# EAGLE design hfm_adapter_nucleo-32 (EAGLE 9.1.1)

## Sheet 1 of 5: MCU
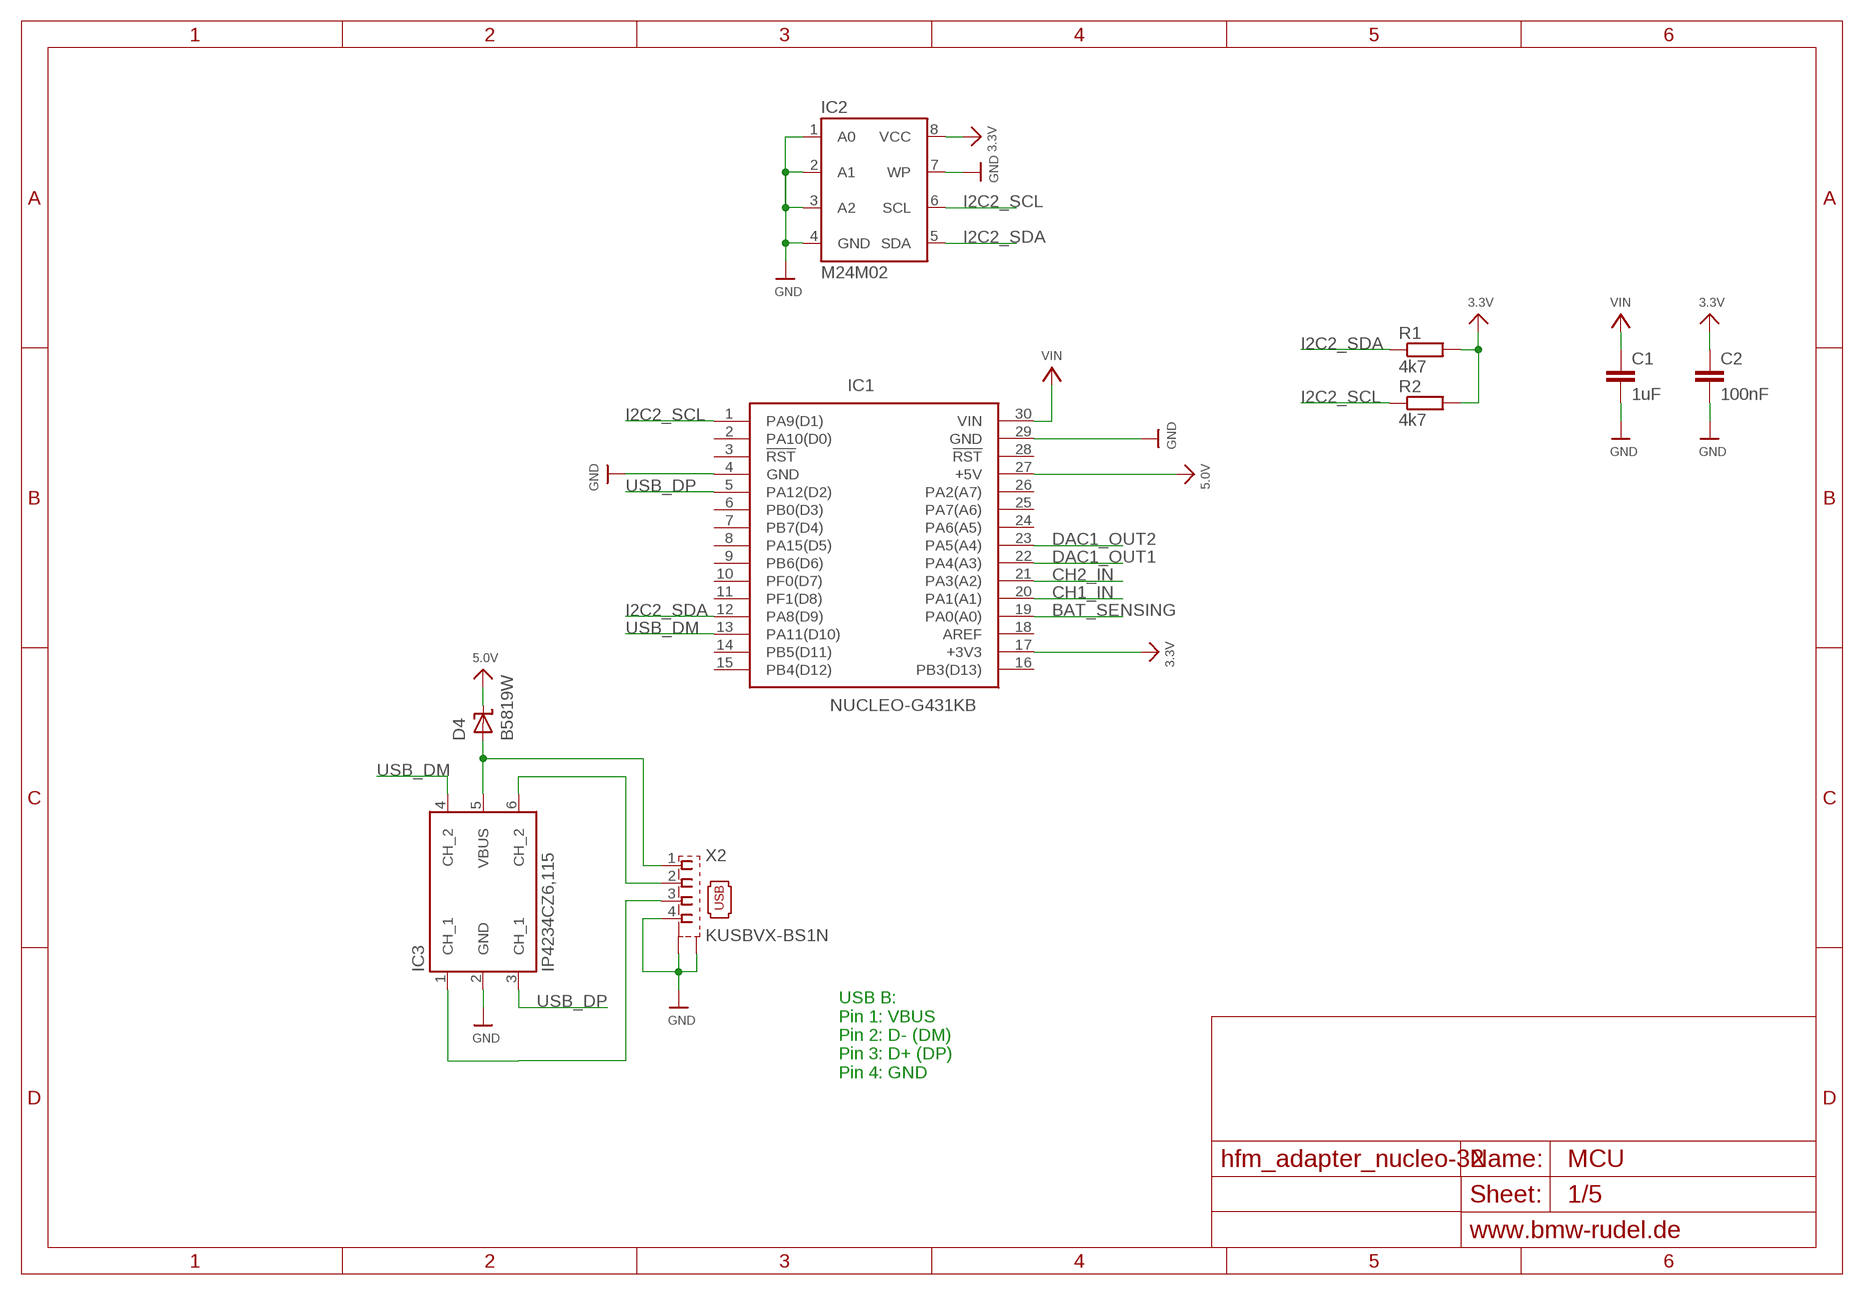
[diagram p0: schematic, sheet 1]

### Parts
C1  1uF  C-EUC0805  [C0805]
C2  100nF  C-EUC0805  [C0805]
D4  B5819W  SHOTTKYSOD-123  [SOD-123]
IC1  NUCLEO-G431KB  [DIPS1524W66P254L5029H1500Q30N]
IC2  M24M02  EEPROM_I2CSO8  [SO8]
IC3  IP4234CZ6,115  [SOT95P275X110-6N]
R1  4k7  R-EU_R0805  [R0805]
R2  4k7  R-EU_R0805  [R0805]
X2  KUSBVX-BS1N  [KUSBVX-BS1N]

### Nets
3.3V: C2.1 IC1.17(+3V3) IC2.8(VCC) R1.2 R2.2 ; also sheet 2
5.0V: D4.C IC1.27(+5V) ; also sheet 2
BAT_SENSING: IC1.19(PA0(A0)) ; also sheet 2
CH1_IN: IC1.20(PA1(A1)) ; also sheet 2
CH2_IN: IC1.21(PA3(A2)) ; also sheet 2
DAC1_OUT1: IC1.22(PA4(A3)) ; also sheet 3
DAC1_OUT2: IC1.23(PA5(A4)) ; also sheet 3
GND: C1.2 C2.2 IC1.4(GND) IC1.29(GND) IC2.1(A0) IC2.2(A1) IC2.3(A2) IC2.4(GND) IC2.7(WP) IC3.2(GND) X2.4 X2.M1(S1) X2.M2(S2) ; also sheet 2,3,4,5
I2C2_SCL: IC1.1(PA9(D1)) IC2.6(SCL) R2.1 ; also sheet 2
I2C2_SDA: IC1.12(PA8(D9)) IC2.5(SDA) R1.1 ; also sheet 2
N$9: IC3.1(CH_1) X2.3
N$12: IC3.6(CH_2) X2.2
N$14: D4.A IC3.5(VBUS) X2.1
USB_DM: IC1.13(PA11(D10)) IC3.4(CH_2)
USB_DP: IC1.5(PA12(D2)) IC3.3(CH_1)
VIN: C1.1 IC1.30(VIN) ; also sheet 3,4
Unconnected: IC1.2(PA10(D0)) IC1.3(!RST) IC1.6(PB0(D3)) IC1.7(PB7(D4)) IC1.8(PA15(D5)) IC1.9(PB6(D6)) IC1.10(PF0(D7)) IC1.11(PF1(D8)) IC1.14(PB5(D11)) IC1.15(PB4(D12)) IC1.16(PB3(D13)) IC1.18(AREF) IC1.24(PA6(A5)) IC1.25(PA7(A6)) IC1.26(PA2(A7)) IC1.28(!RST)

### Notes on the sheet
- USB B:
  Pin 1: VBUS
  Pin 2: D- (DM)
  Pin 3: D+ (DP)
  Pin 4: GND

## Sheet 2 of 5: Input
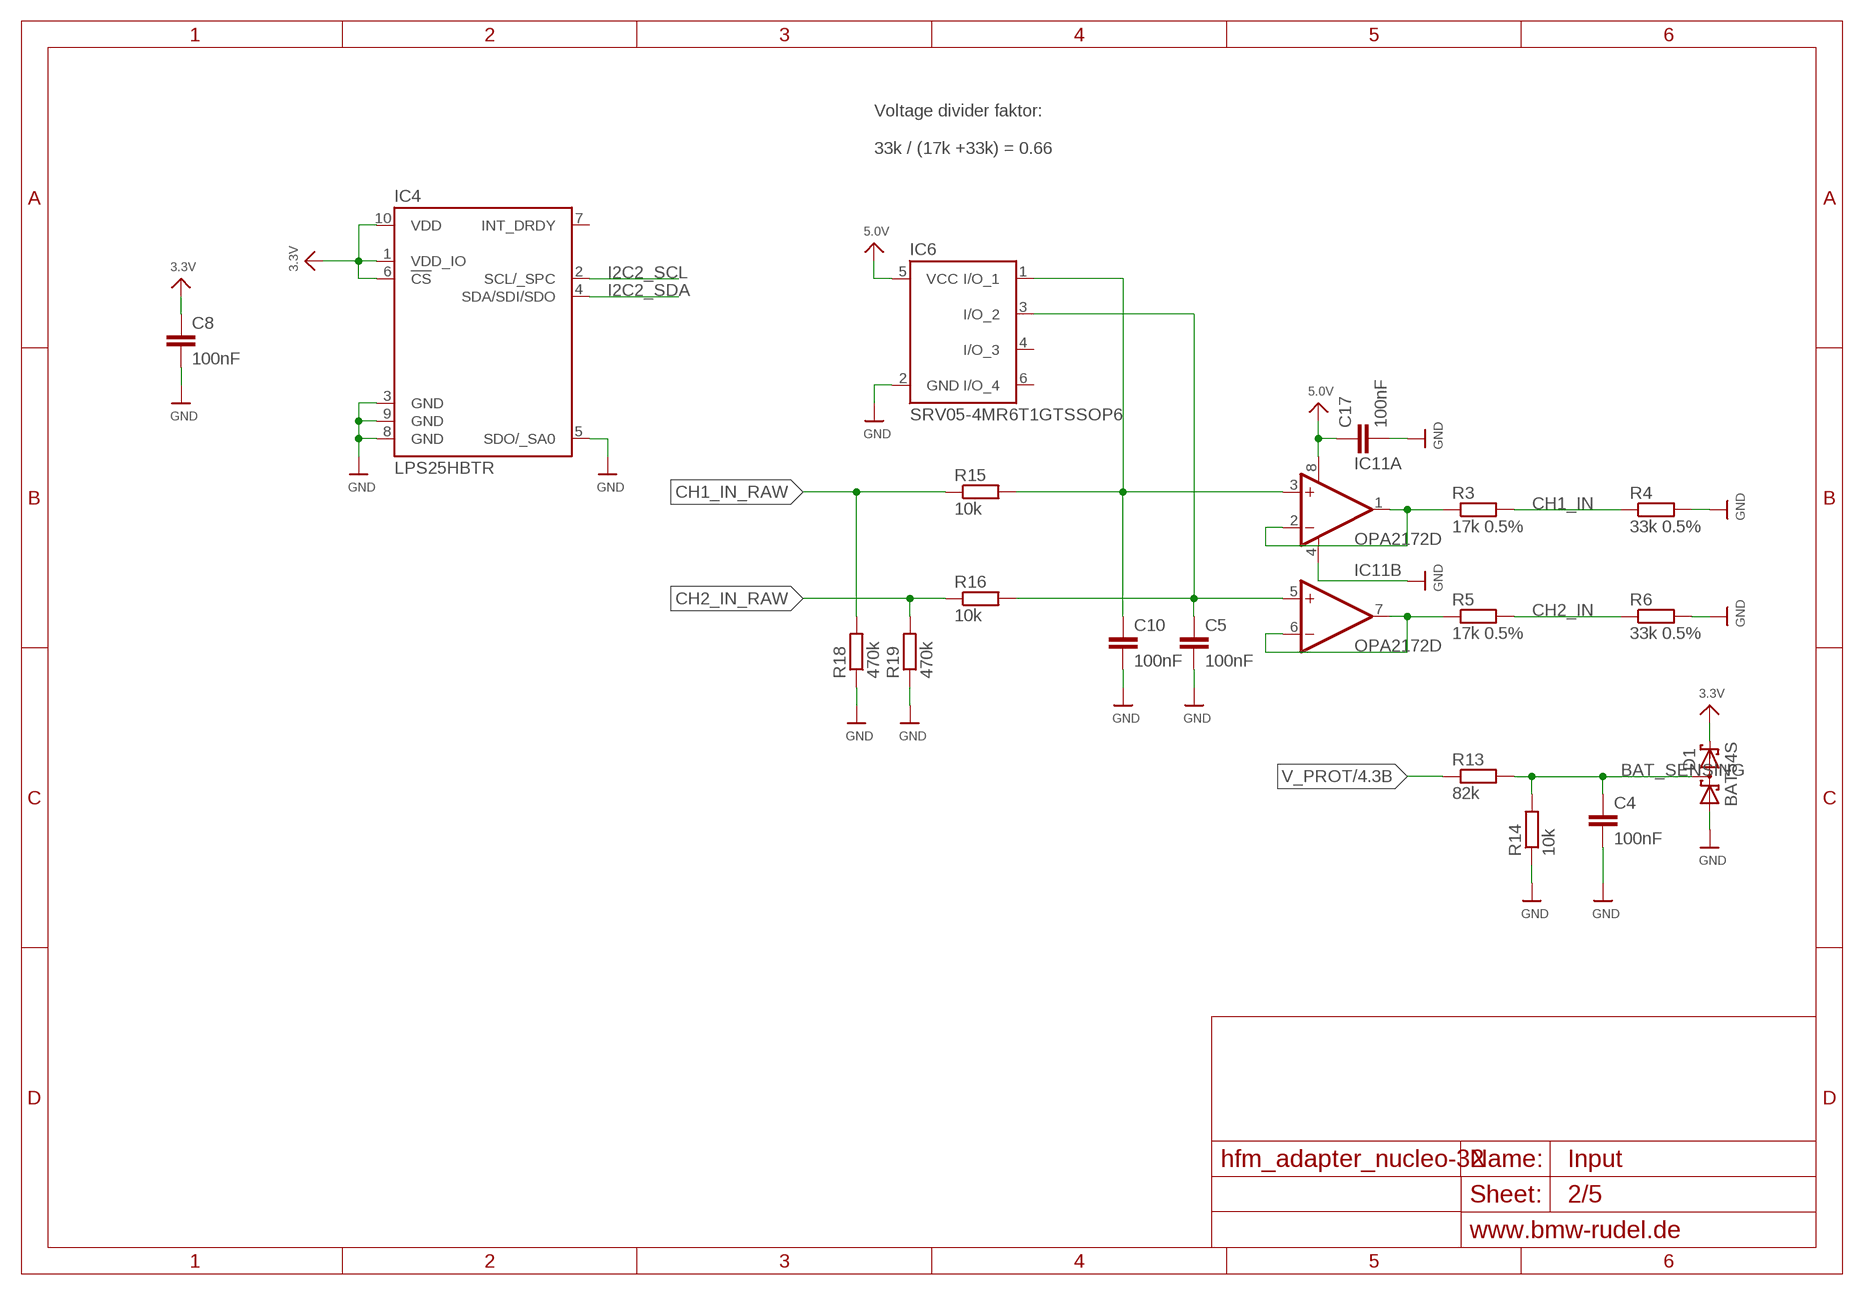
[diagram p1: schematic, sheet 2]

### Parts
C4  100nF  C-EUC0805  [C0805]
C5  100nF  C-EUC0805  [C0805]
C8  100nF  C-EUC0805  [C0805]
C10  100nF  C-EUC0805  [C0805]
C17  100nF  C-EUC0805  [C0805]
D1  BAT54S  [SOT23]
IC4  LPS25HBTR  [LPS25HBTR]
IC6  SRV05-4MR6T1GTSSOP6  [TSSOP6]
IC11  OPA2172D  [SO08]
R3  17k 0.5%  R-EU_R0805  [R0805]
R4  33k 0.5%  R-EU_R0805  [R0805]
R5  17k 0.5%  R-EU_R0805  [R0805]
R6  33k 0.5%  R-EU_R0805  [R0805]
R13  82k  R-EU_R0805  [R0805]
R14  10k  R-EU_R0805  [R0805]
R15  10k  R-EU_R0805  [R0805]
R16  10k  R-EU_R0805  [R0805]
R18  470k  R-EU_R0805  [R0805]
R19  470k  R-EU_R0805  [R0805]

### Nets
3.3V: C8.1 D1.2(K2) IC4.1(VDD_IO) IC4.6(!CS) IC4.10(VDD) ; also sheet 1
5.0V: C17.1 IC6.5(VCC) IC11.8(A:V+) ; also sheet 1
BAT_SENSING: C4.1 D1.3(K1A2) R13.2 R14.2 ; also sheet 1
CH1_IN: R3.2 R4.1 ; also sheet 1
CH1_IN_RAW: R15.1 R18.2 ; also sheet 5
CH2_IN: R5.2 R6.1 ; also sheet 1
CH2_IN_RAW: R16.1 R19.2 ; also sheet 5
GND: C4.2 C5.2 C8.2 C10.2 C17.2 D1.1(A1) IC4.3(GND) IC4.5(SDO/_SA0) IC4.8(GND) IC4.9(GND) IC6.2(GND) IC11.4(A:V-) R4.2 R6.2 R14.1 R18.1 R19.1 ; also sheet 1,3,4,5
I2C2_SCL: IC4.2(SCL/_SPC) ; also sheet 1
I2C2_SDA: IC4.4(SDA/SDI/SDO) ; also sheet 1
N$1: IC11.1(A:OUT) IC11.2(A:-IN) R3.1
N$3: C10.1 IC6.1(I/O_1) IC11.3(A:+IN) R15.2
N$6: IC11.6(B:-IN) IC11.7(B:OUT) R5.1
N$8: C5.1 IC6.3(I/O_2) IC11.5(B:+IN) R16.2
V_PROT: R13.1 ; also sheet 4
Unconnected: IC4.7(INT_DRDY) IC6.4(I/O_3) IC6.6(I/O_4)

### Notes on the sheet
- Voltage divider faktor:
  
  33k / (17k +33k) = 0.66

## Sheet 3 of 5: Output
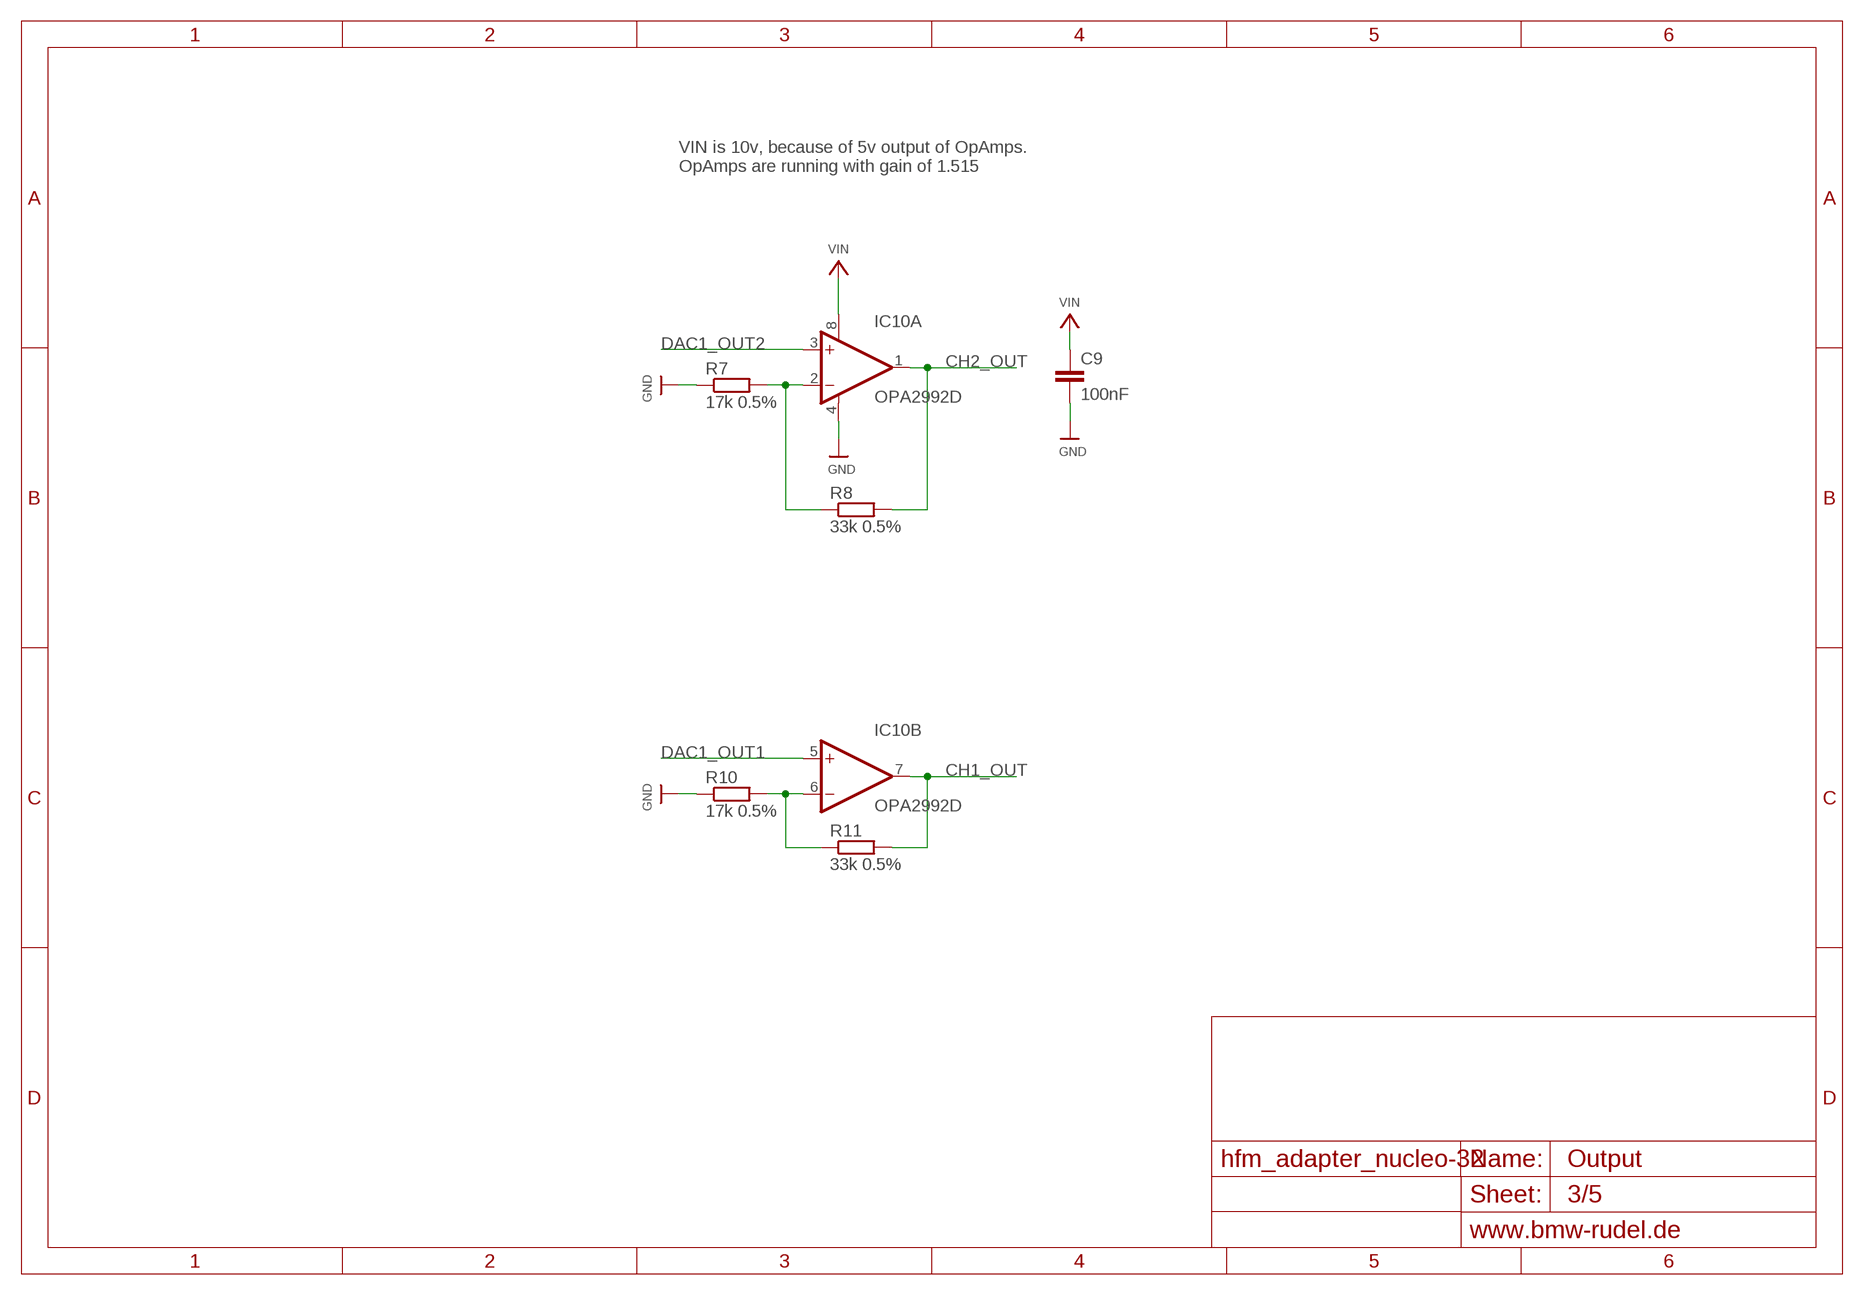
[diagram p2: schematic, sheet 3]

### Parts
C9  100nF  C-EUC0805  [C0805]
IC10  OPA2992D  OPA2172D  [SO08]
R7  17k 0.5%  R-EU_R0805  [R0805]
R8  33k 0.5%  R-EU_R0805  [R0805]
R10  17k 0.5%  R-EU_R0805  [R0805]
R11  33k 0.5%  R-EU_R0805  [R0805]

### Nets
CH1_OUT: IC10.7(B:OUT) R11.2 ; also sheet 5
CH2_OUT: IC10.1(A:OUT) R8.2 ; also sheet 5
DAC1_OUT1: IC10.5(B:+IN) ; also sheet 1
DAC1_OUT2: IC10.3(A:+IN) ; also sheet 1
GND: C9.2 IC10.4(A:V-) R7.1 R10.1 ; also sheet 1,2,4,5
N$2: IC10.6(B:-IN) R10.2 R11.1
N$4: IC10.2(A:-IN) R7.2 R8.1
VIN: C9.1 IC10.8(A:V+) ; also sheet 1,4

### Notes on the sheet
- VIN is 10v, because of 5v output of OpAmps.
  OpAmps are running with gain of 1.515

## Sheet 4 of 5: Power
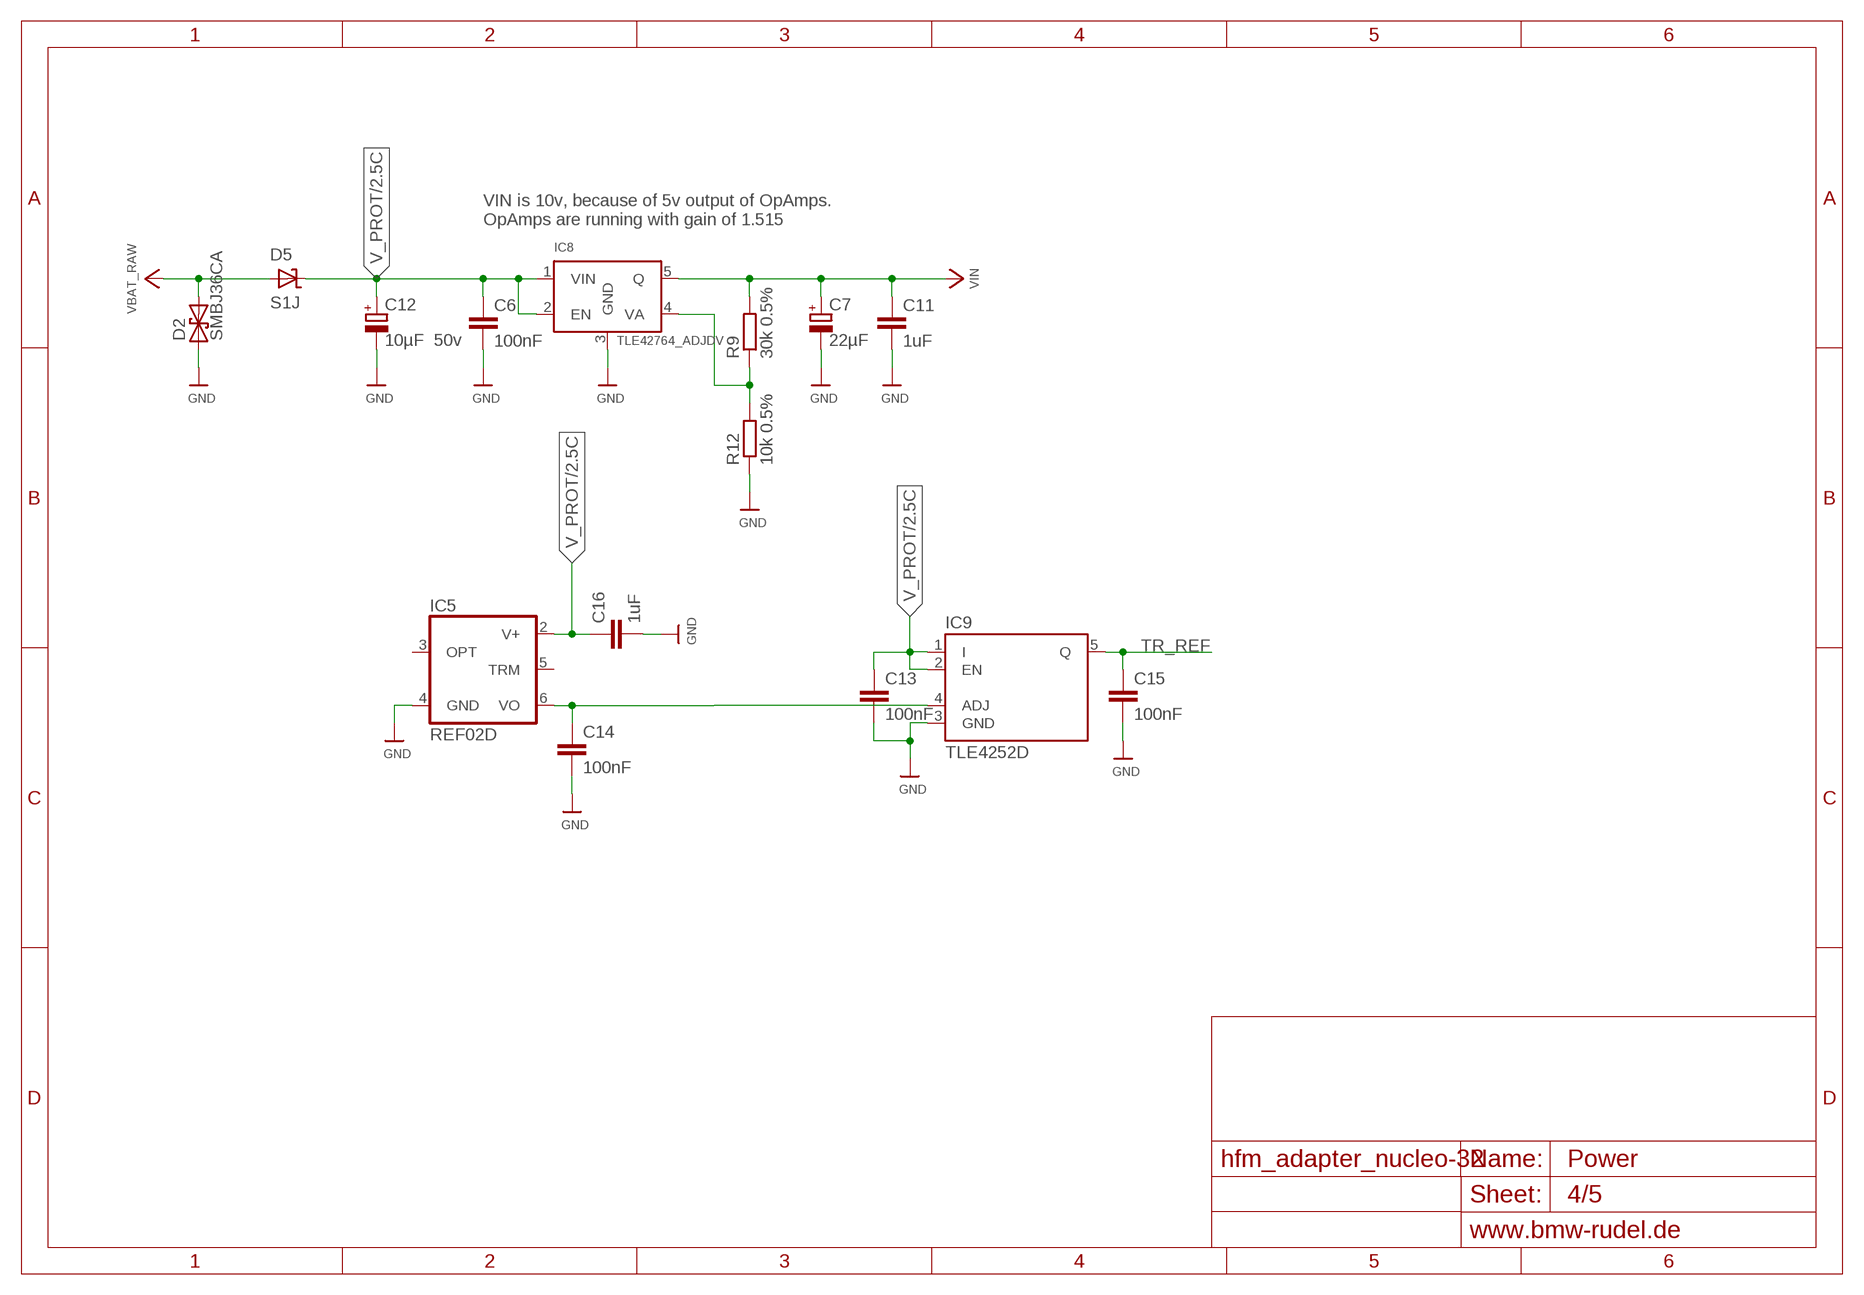
[diagram p3: schematic, sheet 4]

### Parts
C6  100nF  C-EUC1206  [C1206]
C7  22µF  CPOL-EUC  [PANASONIC_C]
C11  1uF  C-EUC0805  [C0805]
C12  10µF 50v  CPOL-EUD  [PANASONIC_D]
C13  100nF  C-EUC0805  [C0805]
C14  100nF  C-EUC0805  [C0805]
C15  100nF  C-EUC0805  [C0805]
C16  1uF  C-EUC0805  [C0805]
D2  SMBJ36CA  TVS_BIA  [DO214AA]
D5  S1J  SHOTTKYSMA  [DO214AC]
IC5  REF02D  [SO08]
IC8  TLE42764_ADJDV  [TO252-51]
IC9  TLE4252D  [TO252-51]
R9  30k 0.5%  R-EU_R0805  [R0805]
R12  10k 0.5%  R-EU_R0805  [R0805]

### Nets
GND: C6.2 C7.- C11.2 C12.- C13.2 C14.2 C15.2 C16.2 D2.A IC5.4(GND) IC8.3(GND) IC9.3(GND) R12.1 ; also sheet 1,2,3,5
N$5: IC8.4(VA) R9.1 R12.2
TR_REF: C15.1 IC9.5(Q) ; also sheet 5
V_PROT: C6.1 C12.+ C13.1 C16.1 D5.C IC5.2(V+) IC8.1(VIN) IC8.2(EN) IC9.1(I) IC9.2(EN) ; also sheet 2
VBAT_RAW: D2.C D5.A ; also sheet 5
VIN: C7.+ C11.1 IC8.5(Q) R9.2 ; also sheet 1,3
VREF: C14.1 IC5.6(VO) IC9.4(ADJ)
Unconnected: IC5.3(OPT) IC5.5(TRM)

### Notes on the sheet
- VIN is 10v, because of 5v output of OpAmps.
  OpAmps are running with gain of 1.515

## Sheet 5 of 5: Connections
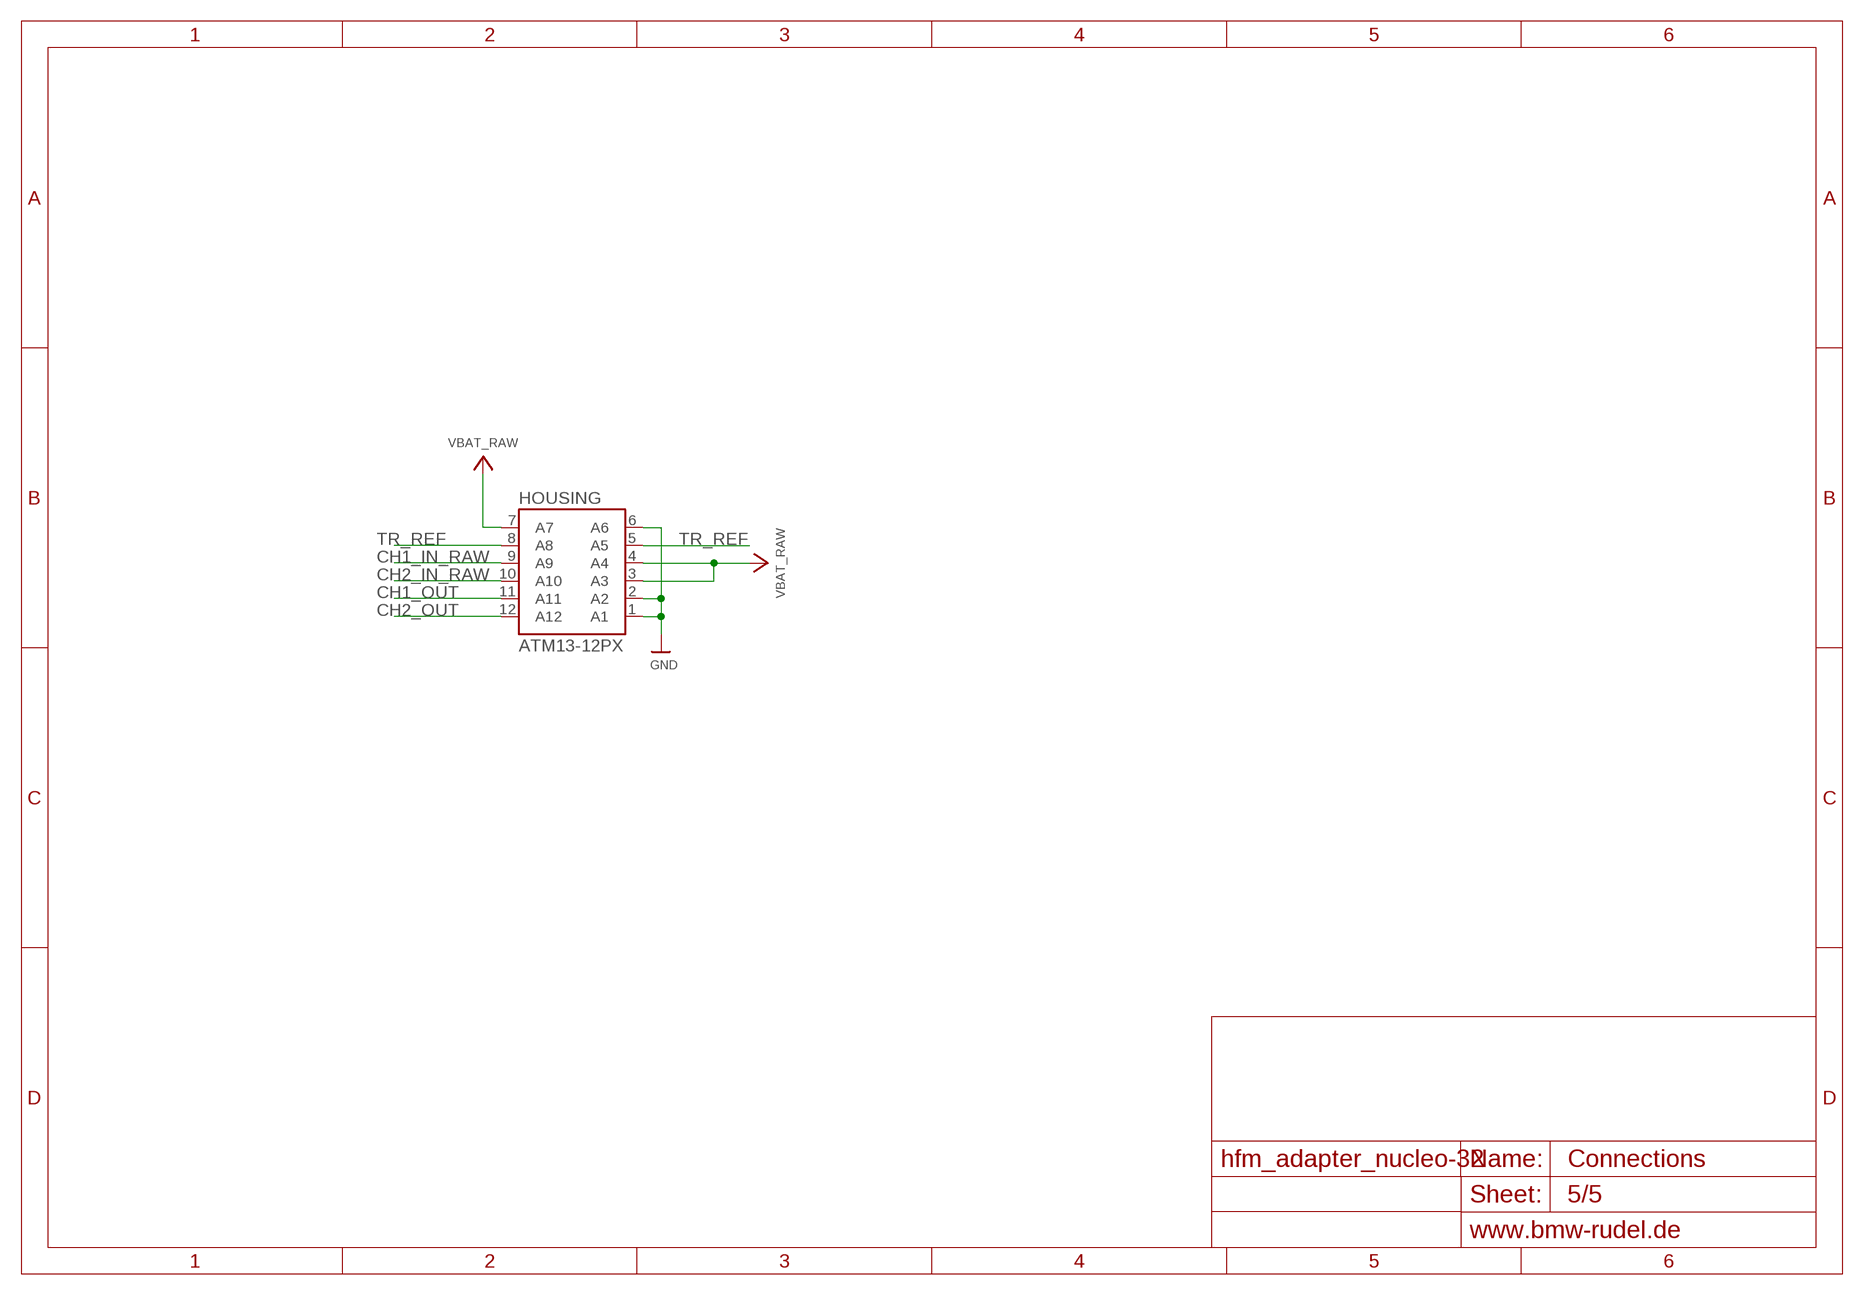
[diagram p4: schematic, sheet 5]

### Parts
HOUSING  ATM13-12PX  [ATM13-12PX]

### Nets
CH1_IN_RAW: HOUSING.9(A9) ; also sheet 2
CH1_OUT: HOUSING.11(A11) ; also sheet 3
CH2_IN_RAW: HOUSING.10(A10) ; also sheet 2
CH2_OUT: HOUSING.12(A12) ; also sheet 3
GND: HOUSING.1(A1) HOUSING.2(A2) HOUSING.6(A6) ; also sheet 1,2,3,4
TR_REF: HOUSING.5(A5) HOUSING.8(A8) ; also sheet 4
VBAT_RAW: HOUSING.3(A3) HOUSING.4(A4) HOUSING.7(A7) ; also sheet 4

## Library data of the parts
C1 C2 C4-C6 C8-C11 C13-C17 = rcl:C-EU: CAPACITOR, European symbol; SPICEPREFIX: C
C7 C12 = rcl:CPOL-EU: POLARIZED CAPACITOR, European symbol; SPICEPREFIX: C
D1 = nxp_60_1_1:BAT54S: Schottky barrier (double) diodes Planar Schottky barrier diodes encapsulated in a SOT23 small plastic SMD package. Single diodes and double diodes with different pinning are available. AAL Eindhoven MK
D2 = Heinrich:TVS_BI
D4 D5 = Heinrich:SHOTTKY
HOUSING = Heinrich:ATM13-12PX
IC1 = NUCLEO-G431KB:NUCLEO-G431KB: STM32 Nucleo-32 development board Source: Datasheet <http://www.st.com/content/ccc/resource/technical/document/data_brief/b1/d8/13/d4/b0/b7/4b/6e/DM00214578.pdf/files/DM00214578.pdf/jcr:content/translations/en.DM00214578.pdf>; ARROW_PART_NUMBER: NUCLEO-F303K8; ARROW_PRICE-STOCK: https://www.arrow.com/en/products/nucleo-f303k8/stmicroelectronics; DESCRIPTION: STM32 Nucleo-32 development board; HEIGHT: 15mm; MANUFACTURER_NAME: STMicroelectronics; MANUFACTURER_PART_NUMBER: NUCLEO-F303K8; RS_PART_NUMBER: 9092862; RS_PRICE-STOCK: http://uk.rs-online.com/web/p/products/9092862
IC2 = Heinrich:EEPROM_I2C: I²C EEPROM IC, i.e. FT24C256A
IC3 = Heinrich:IP4234CZ6,115: ESD Suppressors / TVS Diodes ESD PRTCT/HI SPD INF ZEN LOW VLTG CLMP Source: Datasheet <https://assets.nexperia.com/documents/data-sheet/IP4234CZ6.pdf>; ARROW_PART_NUMBER: IP4234CZ6,115; ARROW_PRICE-STOCK: null?region=nac; DESCRIPTION: ESD Suppressors / TVS Diodes ESD PRTCT/HI SPD INF ZEN LOW VLTG CLMP; HEIGHT: 1.1mm; MANUFACTURER_NAME: Nexperia; MANUFACTURER_PART_NUMBER: IP4234CZ6,115; MOUSER_PART_NUMBER: 771-IP4234CZ6; MOUSER_PRICE-STOCK: https://www.mouser.co.uk/ProductDetail/Nexperia/IP4234CZ6115?qs=iS%252BvaFGfLooAQ%252BprbRTkIg%3D%3D
IC4 = Heinrich:LPS25HBTR: Board Mount Pressure Sensor 26kPa to 126kPa Absolute 10-Pin HLGA T/R Source: Datasheet <https://www.st.com/resource/en/datasheet/lps25hb.pdf>; ARROW_PART_NUMBER: LPS25HBTR; ARROW_PRICE-STOCK: https://www.arrow.com/en/products/lps25hbtr/stmicroelectronics; DESCRIPTION: Board Mount Pressure Sensor 26kPa to 126kPa Absolute 10-Pin HLGA T/R; HEIGHT: 0.8mm; MANUFACTURER_NAME: STMicroelectronics; MANUFACTURER_PART_NUMBER: LPS25HBTR; MOUSER_PART_NUMBER: 511-LPS25HBTR; MOUSER_PRICE-STOCK: https://www.mouser.co.uk/ProductDetail/STMicroelectronics/LPS25HBTR?qs=GDOUxV2YAh9IvjPyBKWGzQ%3D%3D
IC5 = linear:REF02: VOLTAGE REFERENCE
IC6 = Heinrich:SRV05-4MR6T1G; ARROW_PART_NUMBER: SRV05-4MR6T1G; ARROW_PRICE-STOCK: https://www.arrow.com/en/products/srv05-4mr6t1g/on-semiconductor?region=nac; DESCRIPTION: ON SEMICONDUCTOR - SRV05-4MR6T1G - ESD Protection Device, 17.5 V, TSOP, 6 Pins, 300 W; HEIGHT: 1.1mm; MANUFACTURER_NAME: onsemi; MANUFACTURER_PART_NUMBER: SRV05-4MR6T1G; MOUSER_PART_NUMBER: 863-SRV05-4MR6T1G; MOUSER_PRICE-STOCK: https://www.mouser.co.uk/ProductDetail/onsemi/SRV05-4MR6T1G?qs=unWjWFgkqcg61n2fM3DdZg%3D%3D
IC8 = Heinrich:TLE42764_ADJ
IC9 = Heinrich:TLE4252D: Infineon Tracking regualtor output tracking tolerance to reference <= 0.2% 250mA max current
IC10 IC11 = Heinrich:OPA2172: Operational Amplifier; MF: TEXAS INSTRUMENTS; MPN: OPA2234U; OC_FARNELL: 1212441; OC_NEWARK: 96K4523
R1-R16 R18 R19 = rcl:R-EU_: RESISTOR, European symbol; SPICEPREFIX: R
X2 = con-kycon:KUSBVX-BS1N: USB B-type Receptacle Vertical, 4 Position, Through Hole Source: Sibalco Kycon KUSBVX-BS1N-xxx.pdf

## Board
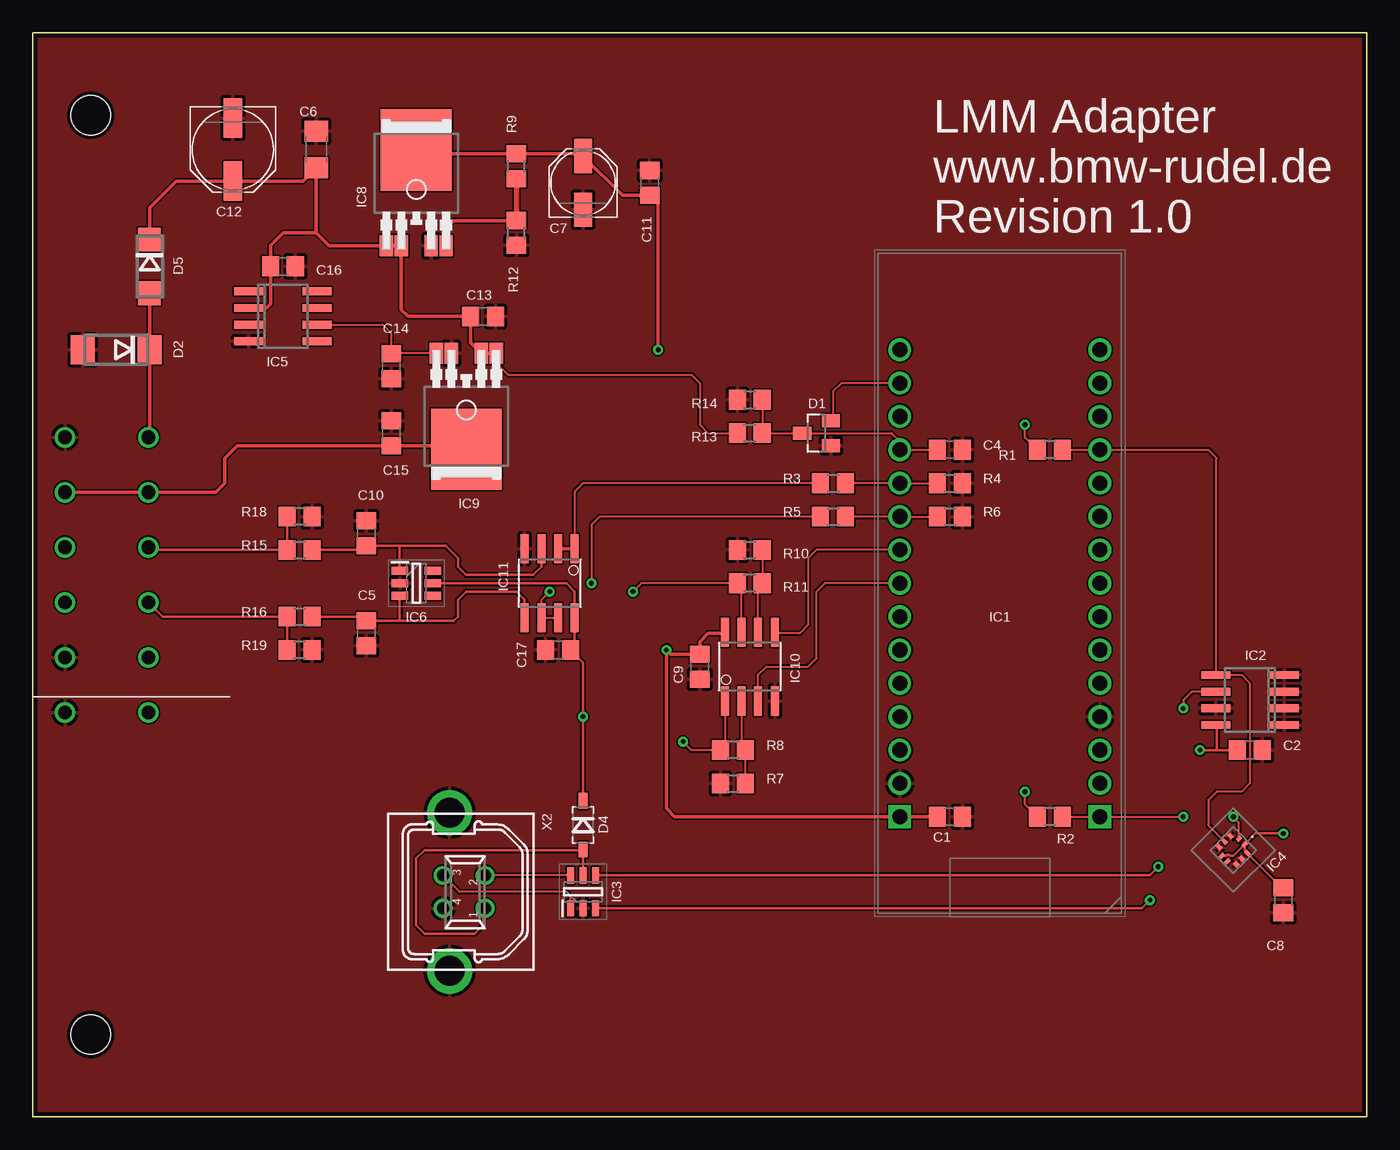
[diagram p5: board, top side]
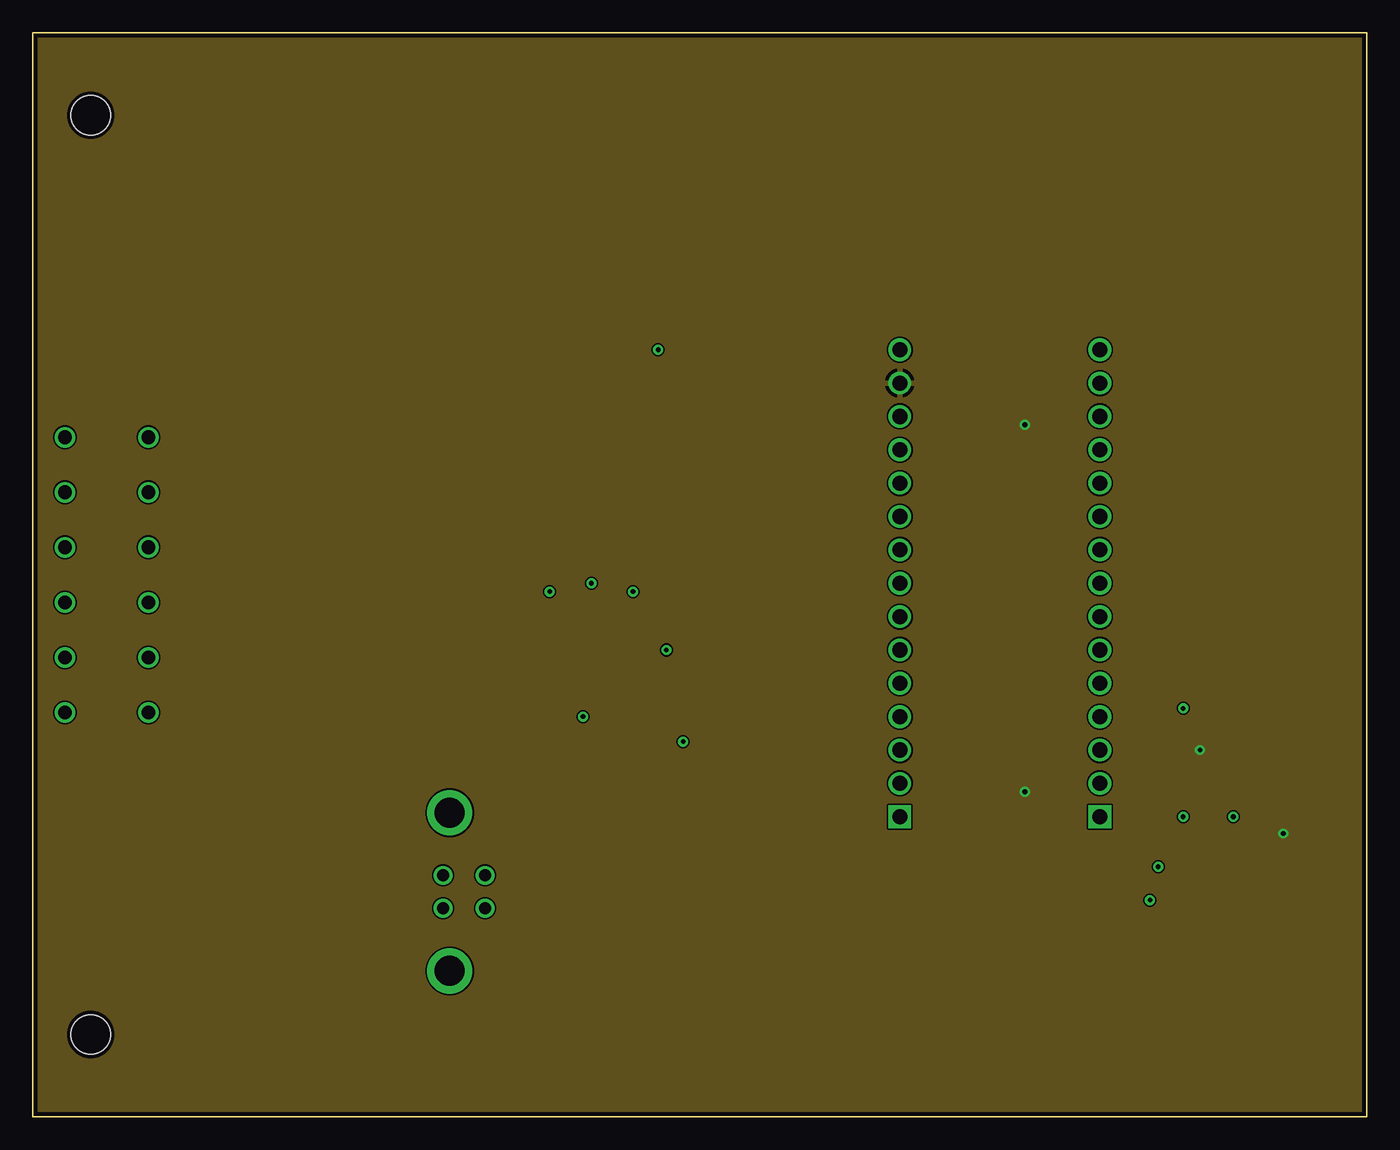
[diagram p6: board, inner layer Route2]
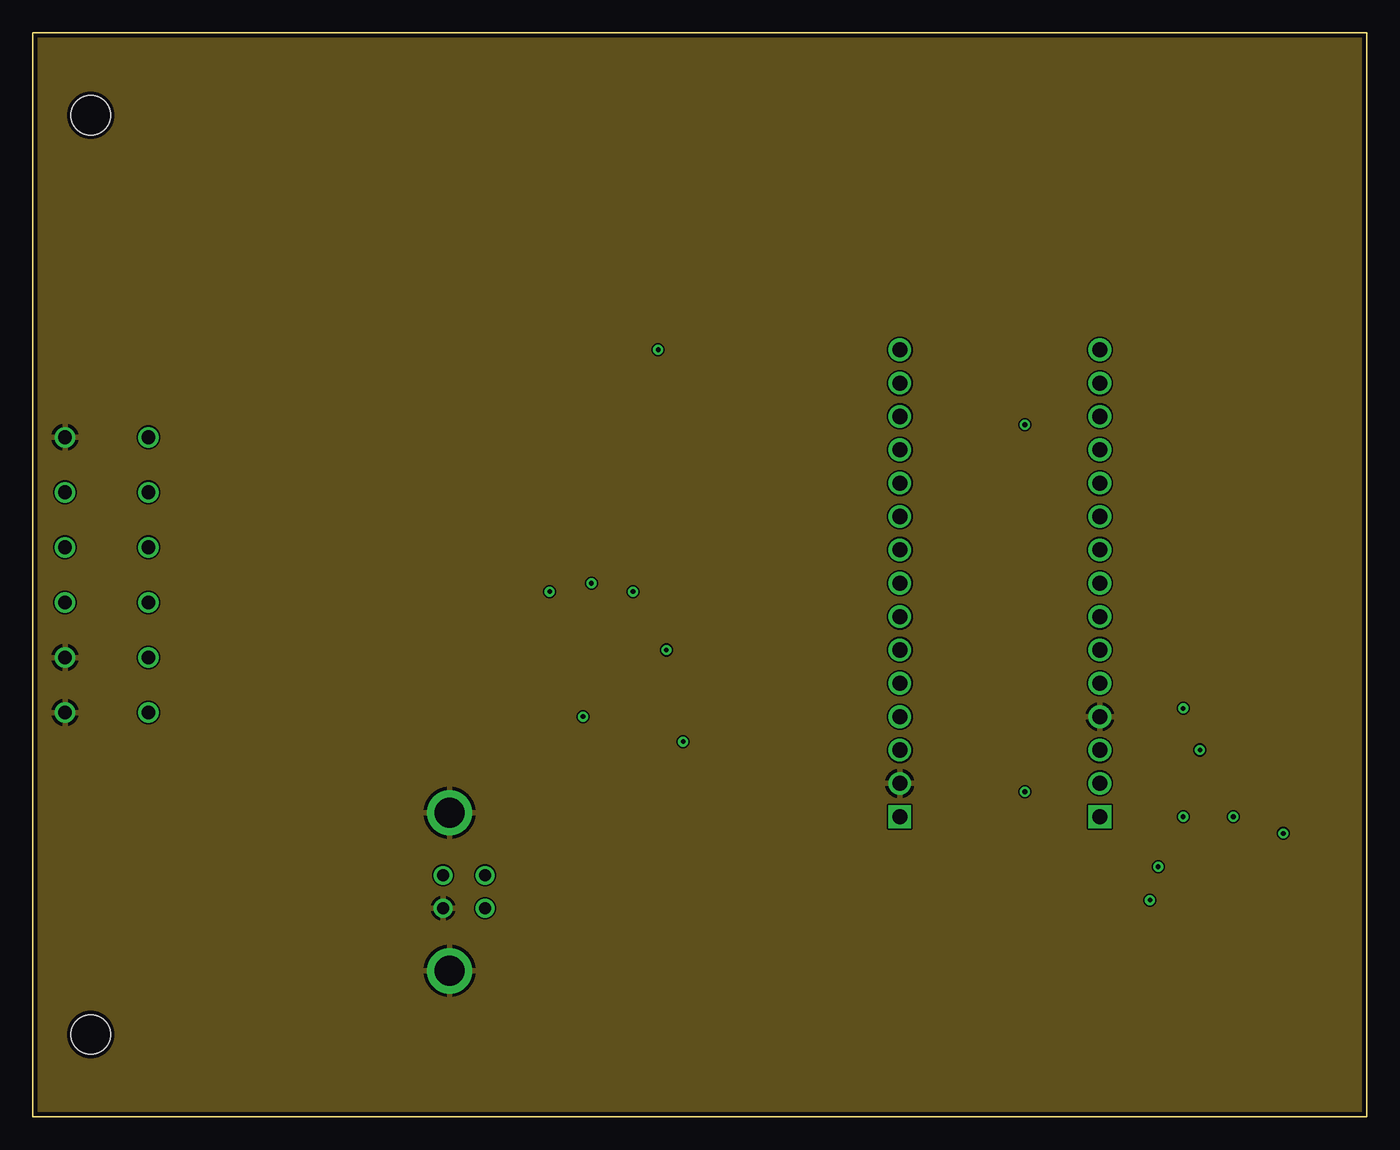
[diagram p7: board, inner layer Route15]
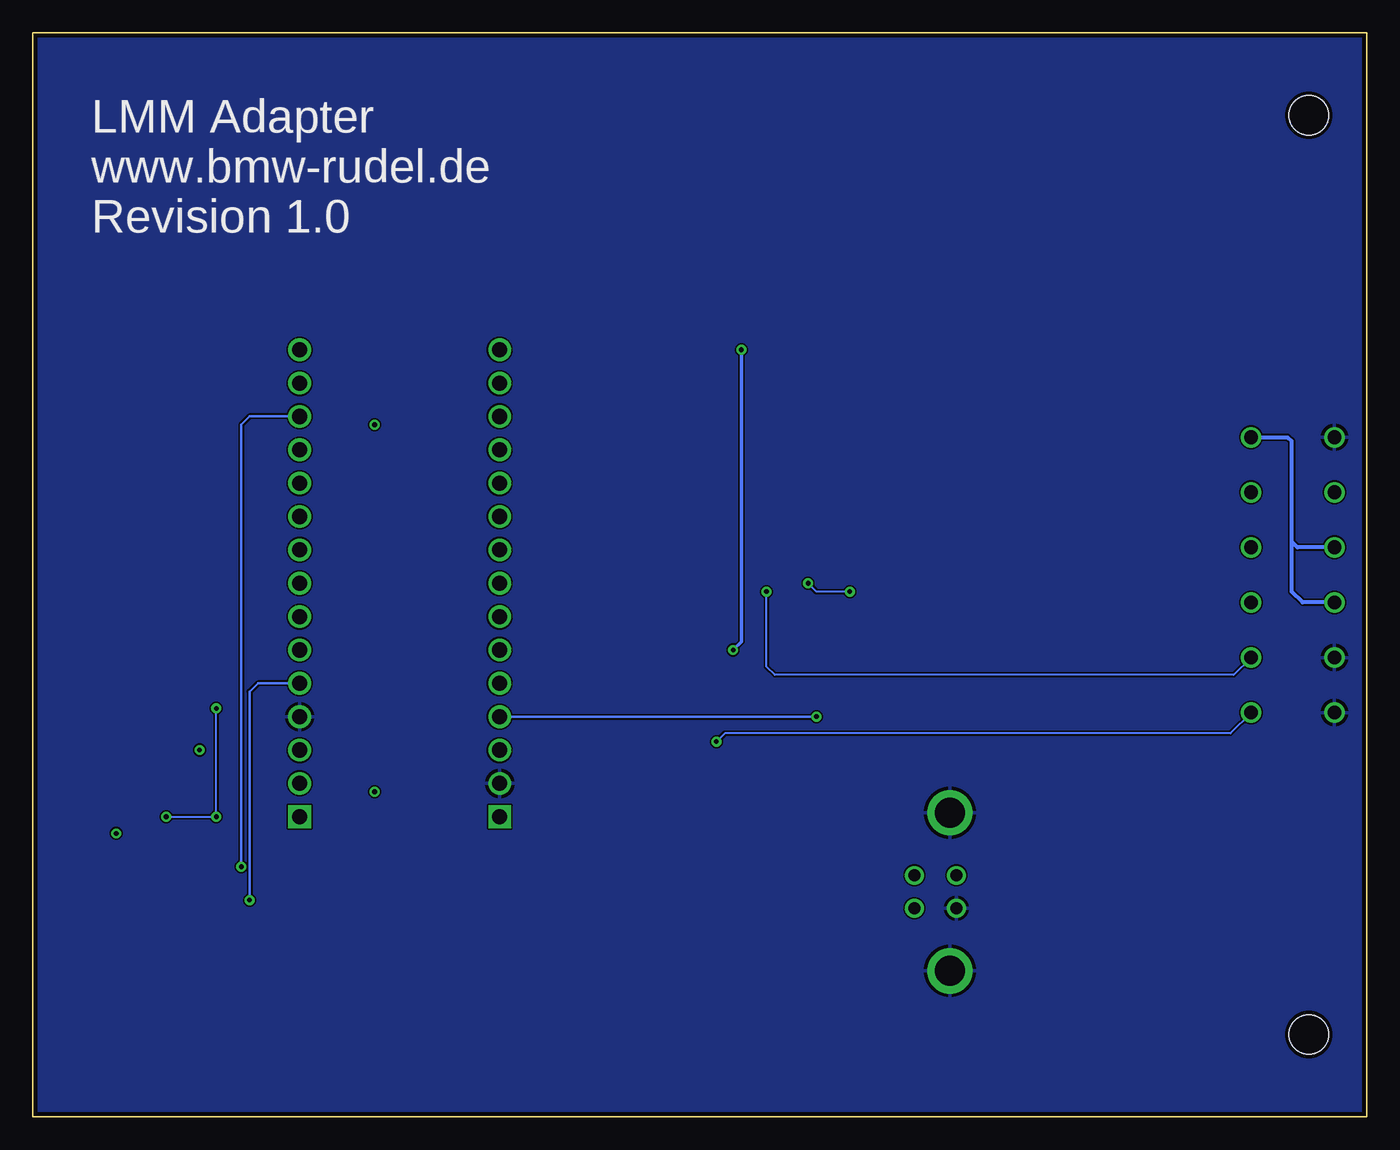
[diagram p8: board, bottom side, seen from below]

Size 101.6 x 82.55 mm. Coordinates in mm from the lower left corner, seen from the top.
Copper layers (1+2*15+16): Top 0.035mm / dielectric 0.2mm / Route2 0.018mm / dielectric 1.5mm / Route15 0.018mm / dielectric 0.2mm / Bottom 0.035mm
Design rules "aisler_4_layer_complex": minimum track width 0.125mm, minimum drill 0.2mm, track to track 0.125mm, track to pad 0.125mm, pad to pad 0.125mm, via to via 0.125mm, smd to smd 0.125mm, copper to edge 0.3mm, drill to drill 0.25mm, minimum pad ring 0.2mm, minimum via ring 0.2mm, stop-mask expansion 0mil, vias tented up to drill 0mil, thermal gap 10mil

### Footprints (pad centres in the part's own frame; a part is rotated, then mirrored left to right if it is on the bottom)
C0805 = smd 1.3 x 1.5: 1 -0.95,0; 2 0.95,0
C1206 = smd 1.6 x 1.8: 1 -1.4,0; 2 1.4,0
PANASONIC_C = smd 2.6 x 1.4: + 2.05,0; - -2.05,0
PANASONIC_D = smd 3 x 1.4: + 2.4,0; - -2.4,0
SOT23 = smd 1 x 1.4: 1 -0.95,-1.1; 2 0.95,-1.1; 3 0,1.1
DO214AA = smd 1.8 x 2.2: A 2.55,0; C -2.55,0
SOD-123 = smd 1.2 x 0.7: A 1.85,0; C -1.85,0
DO214AC = smd 1.8 x 1.7: A 2.05,0; C -2.05,0
ATM13-12PX = drill 1.04: 1 2.45,30.795; 2 2.45,34.985; 3 2.45,39.175; 4 2.45,43.375; 5 2.45,47.565; 6 2.45,51.755; 7 8.8,51.755; 8 8.8,47.565; 9 8.8,43.375; 10 8.8,39.175; 11 8.8,34.985; 12 8.8,30.795 | hole 3: 4.41,6.275; 4.41,76.275
DIPS1524W66P254L5029H1500Q30N = drill 1.15 pad 1.725 square: 1 -7.62,17.78; 30 7.62,17.78 | drill 1.15 pad 1.725: 2 -7.62,15.24; 3 -7.62,12.7; 4 -7.62,10.16; 5 -7.62,7.62; 6 -7.62,5.08; 7 -7.62,2.54; 8 -7.62,0; 9 -7.62,-2.54; 10 -7.62,-5.08; 11 -7.62,-7.62; 12 -7.62,-10.16; 13 -7.62,-12.7; 14 -7.62,-15.24; 15 -7.62,-17.78; 16 7.62,-17.78; 17 7.62,-15.24; 18 7.62,-12.7; 19 7.62,-10.16; 20 7.62,-7.62; 21 7.62,-5.08; 22 7.62,-2.54; 23 7.62,0; 24 7.62,2.54; 25 7.62,5.08; 26 7.62,7.62; 27 7.62,10.16; 28 7.62,12.7; 29 7.62,15.24
SO8 = smd 0.6 x 2.2: 1 -1.905,-2.6; 2 -0.635,-2.6; 3 0.635,-2.6; 4 1.905,-2.6; 5 1.905,2.6; 6 0.635,2.6; 7 -0.635,2.6; 8 -1.905,2.6
SOT95P275X110-6N = smd 1.25 x 0.5: 1 -1.25,0.95; 2 -1.25,0; 3 -1.25,-0.95; 4 1.25,-0.95; 5 1.25,0; 6 1.25,0.95
LPS25HBTR = smd 0.45 x 0.3: 1 -0.92,0.3; 2 -0.92,-0.3; 6 0.92,-0.3; 7 0.92,0.3 | smd 0.3 x 0.45: 3 -0.6,-0.92; 4 0,-0.92; 5 0.6,-0.92; 8 0.6,0.92; 9 0,0.92; 10 -0.6,0.92
SO08 = smd 0.6 x 2.2: 1 -1.905,-2.6; 2 -0.635,-2.6; 3 0.635,-2.6; 4 1.905,-2.6; 5 1.905,2.6; 6 0.635,2.6; 7 -0.635,2.6; 8 -1.905,2.6
TSSOP6 = smd 1.25 x 0.6: 1 -1.25,0.95; 2 -1.25,0; 3 -1.25,-0.95; 4 1.25,-0.95; 5 1.25,0; 6 1.25,0.95
TO252-51 = smd 1 x 1.6: 1 -2.28,-4.8; 2 -1.14,-4.8; 3 1.14,-4.8; 4 2.28,-4.8 | smd 5.4 x 6.2: 5 0,2.5
SO08' = smd 0.61 x 2.21: 1 -1.905,-2.616; 2 -0.635,-2.616; 3 0.635,-2.616; 4 1.905,-2.616; 5 1.905,2.616; 6 0.635,2.616; 7 -0.635,2.616; 8 -1.905,2.616
R0805 = smd 1.3 x 1.5: 1 -0.95,0; 2 0.95,0
KUSBVX-BS1N = drill 0.9 pad 1.422: 1 1.25,2.7; 2 -1.25,2.7; 3 -1.25,-0.5; 4 1.25,-0.5 | drill 2.3 pad 2.7: M1 -6.02,0; M2 6.02,0

### Placement (x,y rotation side)
C1  69.85,22.86 0 top
C2  92.71,27.94 0 top
C4  69.85,50.8 0 top
C5  25.4,36.83 270 top
C6  21.59,73.66 90 top
C7  41.91,71.12 90 top
C8  95.25,16.51 270 top
C9  50.8,34.29 270 top
C10  25.4,44.45 90 top
C11  46.99,71.12 90 top
C12  15.24,73.66 270 top
C13  34.29,60.96 0 top
C14  27.3,57.15 270 top
C15  27.3,52.07 90 top
C16  19.05,64.77 0 top
C17  40.01,35.56 180 top
D1  59.69,52.07 90 top
D2  6.35,58.42 180 top
D4  41.91,22.23 270 top
D5  8.89,64.77 270 top
HOUSING  0,0 0 top
IC1  73.66,40.64 180 top
IC2  92.71,31.75 90 top
IC3  41.91,17.14 90 top
IC4  91.44,20.32 225 top
IC5  19.05,60.96 270 top
IC6  29.21,40.64 0 top
IC8  29.21,71.12 0 top
IC9  33.02,53.34 180 top
IC10  OPA2992D  [SO08']  54.61,34.29 0 top
IC11  OPA2172D  [SO08']  39.37,40.64 180 top
R1  77.47,50.8 180 top
R2  77.47,22.86 180 top
R3  60.96,48.26 0 top
R4  69.85,48.26 0 top
R5  60.96,45.72 0 top
R6  69.85,45.72 0 top
R7  53.34,25.4 0 top
R8  53.34,27.94 180 top
R9  36.83,72.39 90 top
R10  54.61,43.18 0 top
R11  54.61,40.64 180 top
R12  36.83,67.31 90 top
R13  54.61,52.07 0 top
R14  54.61,54.61 0 top
R15  20.32,43.18 0 top
R16  20.32,38.1 0 top
R18  20.32,45.72 180 top
R19  20.32,35.56 180 top
X2  31.75,17.14 270 top

### Tracks (layer width: path | path; a pad name or v marks a point on that pad's centre or on a via)
3.3V  (via drill 0.35)
  Top 0.152: IC1.17 61.59,55.88 60.96,55.24 60.96,53.19 D1.2 | R2.2 75.56,23.82 v75.56,24.77 | R1.2 75.56,51.76 v75.56,52.7
  Top 0.203: IC4.1 92.3,20.31 IC4.10 95.15,17.46 C8.1 | IC4.1 91.43,19.88 91.22,19.88 91.15,19.95 90.96,19.95 90.89,19.88 IC4.6 | IC4.1 93.13,21.59 v95.25,21.59 | IC2.8 90.17,29.79 90.17,27.94 | 90.17,27.94 C2.1 | 90.17,27.94 v88.9,27.94
  pour Route2: 0,82.55 101.6,82.55 101.6,0 0,0
5.0V  (via drill 0.35)
  Top 0.203: IC6.5 40.64,40.64 41.27,40.01 IC11.8 41.27,35.88 C17.1 41.91,34.6 v41.91,30.48 D4.C
  Bottom 0.203: IC1.27 v41.91,30.48
BAT_SENSING
  Top 0.152: R14.2 R13.2 D1.3 65.41,52.07 66.04,51.44 IC1.19 C4.1
CH1_IN
  Top 0.152: R4.1 IC1.20 R3.2
CH1_IN_RAW
  Top 0.203: HOUSING.9 8.99,43.18 19.05,43.18 | 19.05,43.18 R15.1 | R18.2 19.37,43.5 19.05,43.18
CH1_OUT  (via drill 0.35)
  Top 0.152: IC10.7 53.98,40.33 R11.2 46.35,40.64 v45.72,40.01
  Bottom 0.152: HOUSING.11 10.13,33.66 45.09,33.66 45.72,34.29 v45.72,40.01
CH2_IN
  Top 0.152: R6.1 IC1.21 R5.2
CH2_IN_RAW
  Top 0.203: HOUSING.10 9.88,38.1 R16.1 R19.2
CH2_OUT  (via drill 0.35)
  Top 0.152: IC10.1 52.7,28.25 R8.2 50.16,27.94 v49.53,28.57
  Bottom 0.152: HOUSING.12 10.38,29.21 48.9,29.21 v49.53,28.57
DAC1_OUT1
  Top 0.152: 56.59,36.83 56.55,36.87 | 56.55,36.87 IC10.5 | IC1.22 59.69,43.18 59.05,42.55 59.05,37.47 58.42,36.83 56.59,36.83 | 56.59,36.83 56.55,36.87
DAC1_OUT2
  Top 0.152: IC1.23 60.33,40.64 59.69,40.01 59.69,34.92 59.05,34.29 55.88,34.29 55.24,33.66 IC10.3
GND
  pour Top: 0,82.55 101.6,82.55 101.6,0 0,0
  pour Bottom: 101.6,82.55 0,82.55 0,0 101.6,0
  pour Route15: 0,82.55 101.6,82.55 101.6,0 0,0
I2C2_SCL  (via drill 0.35)
  Top 0.152: R2.1 IC1.1 v87.63,22.86 | IC2.6 88.27,32.38 87.63,31.75 v87.63,31.11 | IC4.2 91.88,22.42 v91.44,22.86
  Bottom 0.152: v87.63,31.11 v87.63,22.86 v91.44,22.86
I2C2_SDA
  Top 0.152: R1.1 IC1.12 89.53,50.8 90.17,50.16 90.11,50.1 IC2.5 92.08,33.66 92.71,33.02 92.71,25.4 92.08,24.77 90.17,24.77 89.53,24.13 89.53,22.23 IC4.4
N$1
  Top 0.152: R3.1 41.91,48.26 41.27,47.62 IC11.1
  Top 0.254: IC11.2 IC11.1
N$2
  Top 0.152: IC10.6 55.24,40.33 R11.1 R10.2
N$3
  Top 0.203: R15.2 25.08,43.18 C10.1 27.94,43.5 | 27.94,43.5 31.43,43.5 32.38,42.55 32.38,41.91 33.02,41.27 38.1,41.27 38.73,41.91 IC11.3 | IC6.1 27.94,41.61 27.94,43.5
N$4
  Top 0.152: IC10.2 53.98,28.25 R8.1 R7.2
N$5
  Top 0.254: IC8.4 31.49,67.69 32.06,68.26 R12.2
  Top 0.406: R12.2 36.83,68.58 R9.1
N$6  (via drill 0.35)
  Top 0.152: R5.1 43.18,45.72 42.55,45.09 v42.55,40.64 | IC11.7 IC11.6 38.73,39.37 v39.37,40.01
  Bottom 0.152: v39.37,40.01 41.91,40.01 v42.55,40.64
N$8
  Top 0.203: R16.2 25.08,38.1 C5.1 27.94,37.78 | 27.94,37.78 32.06,37.78 32.38,38.1 32.38,39.37 33.02,40.01 36.83,40.01 37.47,39.37 IC11.5 | IC6.3 27.94,39.67 27.94,37.78
N$9
  Top 0.152: X2.3 32.5,17.14 40.64,17.14 40.96,16.82 IC3.1
N$12
  Top 0.152: IC3.6 X2.2
N$14
  Top 0.203: IC3.5 41.91,20.32 | 41.91,20.32 D4.A | X2.1 34.29,15.73 34.29,14.61 33.66,13.97 29.84,13.97 29.21,14.61 29.21,19.68 29.84,20.32 41.91,20.32
TR_REF
  Top 0.254: IC9.5 32.98,50.8 32.38,50.8 32.06,51.12 C15.1 15.56,51.12 14.61,50.16 14.61,48.26 13.91,47.56 HOUSING.8 HOUSING.5
USB_DM  (via drill 0.35)
  Top 0.203: IC3.4 42.88,18.41 85.09,18.41 v85.72,19.05
  Bottom 0.203: IC1.13 85.09,53.34 85.72,52.7 v85.72,19.05
USB_DP  (via drill 0.35)
  Top 0.203: IC3.3 84.47,15.89 v85.09,16.51
  Bottom 0.203: IC1.5 84.45,33.02 85.09,32.38 v85.09,16.51
V_PROT
  Top 0.152: IC9.1 35.3,57.41 36.2,56.52 50.16,56.52 50.8,55.88 50.8,52.7 51.44,52.07 R13.1
  Top 0.254: D5.C 8.89,69.22 10.94,71.26 C12.+ 20.59,71.26 C6.1 21.59,67.31 | 21.59,67.31 22.58,66.32 IC8.1 IC8.2 28.07,61.47 28.57,60.96 C13.1 33.34,58.96 IC9.2 IC9.1 | IC5.2 17.78,61.59 18.1,61.91 C16.1 18.1,66.36 19.05,67.31 21.59,67.31
VBAT_RAW
  Top 0.254: HOUSING.7 8.9,51.85 D2.C D5.A
  Bottom 0.305: HOUSING.7 6.04,51.76 5.71,51.44 5.71,43.81 | 5.71,43.81 5.71,43.18 5.71,40.01 4.88,39.17 HOUSING.3 | HOUSING.4 5.28,43.38 5.71,43.81
VIN  (via drill 0.35)
  Top 0.254: 29.49,73.34 R9.2 41.74,73.34 C7.+ 44.91,70.17 C11.1 47.62,69.53 v47.62,58.42 | C1.1 IC1.30 48.9,22.86 48.26,23.5 v48.26,35.56 48.58,35.24 C9.1 50.8,36.2 51.44,36.83 52.63,36.83 IC10.8
  Top 0.406: 29.49,73.34 IC8.5
  Bottom 0.254: v47.62,58.42 47.62,36.2 v48.26,35.56
VREF
  Top 0.152: IC5.6 26.67,60.33 27.3,59.69 C14.1 27.34,58.14 IC9.4

### Text on the board
tNames: LMM Adapter / www.bmw-rudel.de / Revision 1.0
bNames: LMM Adapter / www.bmw-rudel.de / Revision 1.0